# EAGLE design bgboy_modul (EAGLE 6.6.0)
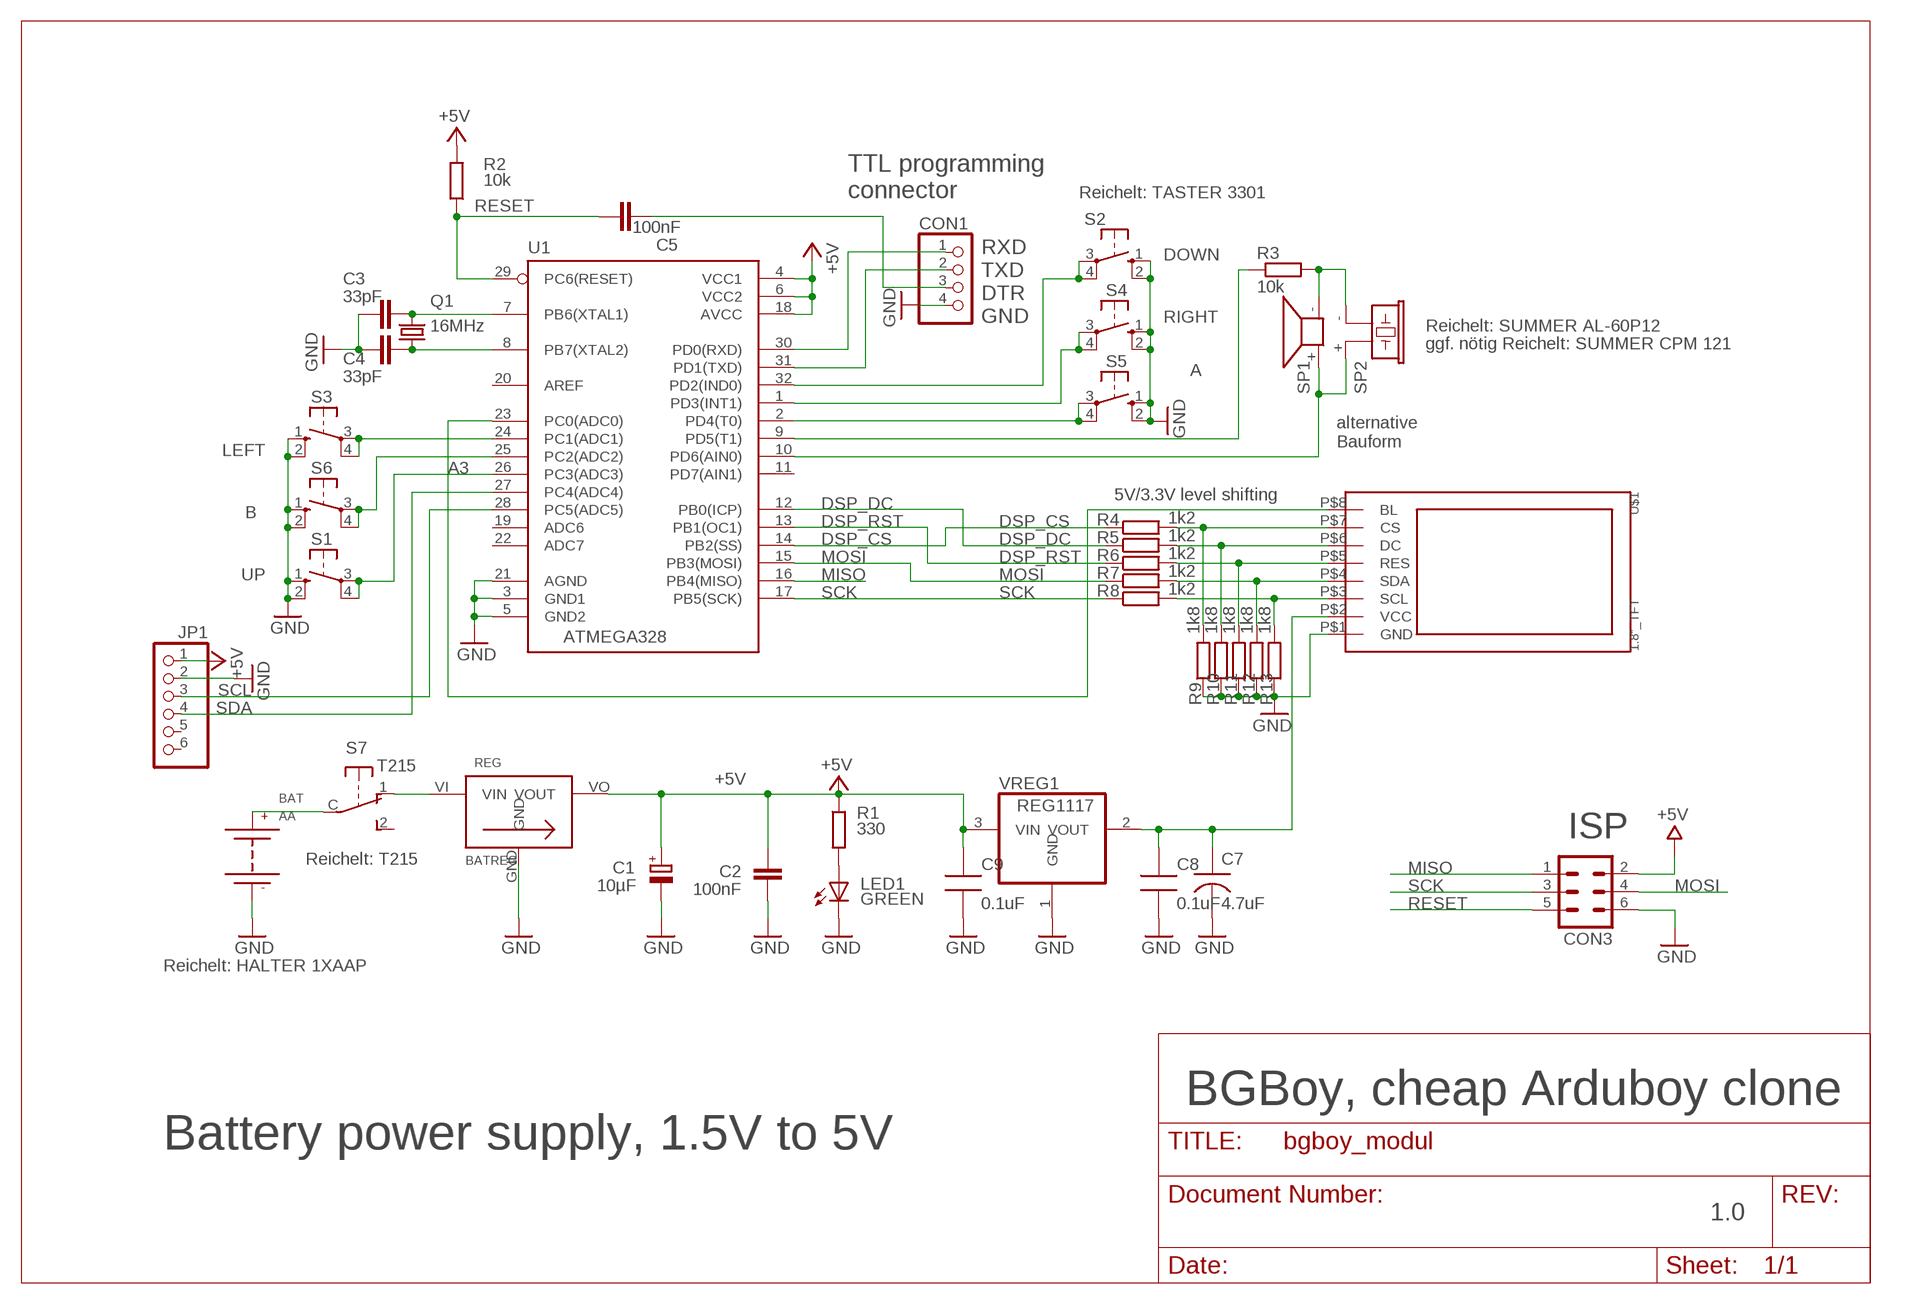
[diagram p0: schematic, sheet 1]

## Parts
BAT  AA  [1XAAP]
C1  10µF  CPOL-EUSMCD  [SMC_D]
C2  100nF  C-EUC0805  [C0805]
C3  33pF  C-EUC0805  [C0805]
C4  33pF  C-EUC0805  [C0805]
C5  100nF  C-EUC0805  [C0805]
C7  4.7uF  CAP-TANA-P  [TAN-A]
C8  0.1uF  CAP0805-NP  [CAP0805-NP]
C9  0.1uF  CAP0805-NP  [CAP0805-NP]
CON1  PINHD-1X4/90  [1X04/90]
CON3  MA03-2  [MA03-2]
JP1  PINHD-1X6  [1X06]
LED1  GREEN  LED3MM  [LED3MM]
Q1  16MHz  CRYSTALHC49UP  [HC49UP]
R1  330  R-EU_R0805  [R0805]
R2  10k  R-EU_R0805  [R0805]
R3  10k  R-EU_R0805  [R0805]
R4  1k2  R-EU_M0805  [M0805]
R5  1k2  R-EU_M0805  [M0805]
R6  1k2  R-EU_M0805  [M0805]
R7  1k2  R-EU_M0805  [M0805]
R8  1k2  R-EU_M0805  [M0805]
R9  1k8  R-EU_M0805  [M0805]
R10  1k8  R-EU_M0805  [M0805]
R11  1k8  R-EU_M0805  [M0805]
R12  1k8  R-EU_M0805  [M0805]
R13  1k8  R-EU_M0805  [M0805]
REG  BATREG  [BATREG]
S1  UP  10-XX  [B3F-10XX]
S2  DOWN  10-XX  [B3F-10XX]
S3  LEFT  10-XX  [B3F-10XX]
S4  RIGHT  10-XX  [B3F-10XX]
S5  A  10-XX  [B3F-10XX]
S6  B  10-XX  [B3F-10XX]
S7  T215  [T215]
SP1  KSS1201  [KSS1201]
SP2  F/CM12P  [F/CM12P]
U1  ATMEGA328  ATMEGA168-20AU  [QFP032]
U$1  1.8"_TFT  [1.8"_TFT]
VREG1  REG1117  [SOT223]

## Nets
+5V [usbvcc]: C1.+ C2.2 C9.1 JP1.1 R1.1 R2.2 REG.VO(VOUT) U1.4(VCC1) U1.6(VCC2) U1.18(AVCC) VREG1.3(VIN)
A0: U1.23(PC0(ADC0)) U$1.P$8(BL)
A1: S3.3(P) S3.4(P1) U1.24(PC1(ADC1))
A2: S6.3(P) S6.4(P1) U1.25(PC2(ADC2))
A3: S1.3(P) S1.4(P1) U1.26(PC3(ADC3))
D0: CON1.1 U1.30(PD0(RXD))
D1: CON1.2 U1.31(PD1(TXD))
D2: S2.3(P) S2.4(P1) U1.32(PD2(IND0))
D3: S4.3(P) S4.4(P1) U1.1(PD3(INT1))
D4: S5.3(P) S5.4(P1) U1.2(PD4(T0))
D5: R3.1 U1.9(PD5(T1))
D7: SP1.+ SP2.+ U1.10(PD6(AIN0))
DSP_CS: R4.1 U1.14(PB2(SS))
DSP_DC: R5.1 U1.12(PB0(ICP))
DSP_RST: R6.1 U1.13(PB1(OC1))
GND [gnd]: BAT.- C1.- C2.1 C3.1 C4.1 C7.2 C8.2 C9.2 CON1.4 CON3.6 JP1.2 LED1.K(C) R9.1 R10.1 R11.1 R12.1 R13.1 REG.GND S1.1(S) S1.2(S1) S2.1(S) S2.2(S1) S3.1(S) S3.2(S1) S4.1(S) S4.2(S1) S5.1(S) S5.2(S1) S6.1(S) S6.2(S1) U1.3(GND1) U1.5(GND2) U1.21(AGND) U$1.P$1(GND) VREG1.1(GND)
MISO: CON3.1 U1.16(PB4(MISO))
MOSI: CON3.4 R7.1 U1.15(PB3(MOSI))
N$1: C4.2 Q1.1 U1.8(PB7(XTAL2))
N$2: C3.2 Q1.2 U1.7(PB6(XTAL1))
N$3: LED1.A R1.2
N$4: REG.VI(VIN) S7.1(O)
N$5: BAT.+ S7.C(P)
N$6: R4.2 R9.2 U$1.P$7(CS)
N$7: R6.2 R11.2 U$1.P$5(RES)
N$8: R3.2 SP1.- SP2.-
N$9: R5.2 R10.2 U$1.P$6(DC)
N$10: C5.2 CON1.3
N$11: C7.1 C8.1 U$1.P$2(VCC) VREG1.2(VOUT)
N$14: R7.2 R12.2 U$1.P$4(SDA)
N$15: R8.2 R13.2 U$1.P$3(SCL)
RESET: C5.1 CON3.5 R2.1 U1.29(PC6(RESET))
SCK: CON3.3 R8.1 U1.17(PB5(SCK))
SCL: JP1.3 U1.28(PC5(ADC5))
SDA: JP1.4 U1.27(PC4(ADC4))
VCC: CON3.2 ; supply symbol labelled +5V
Unconnected: JP1.5 JP1.6 S7.2(S) U1.11(PD7(AIN1)) U1.19(ADC6) U1.20(AREF) U1.22(ADC7)

## Notes on the sheet
- TTL programming
  connector
- Reichelt: TASTER 3301
- RXD
  TXD
  DTR
  GND
- Reichelt: SUMMER AL-60P12
- ggf. nötig Reichelt: SUMMER CPM 121
- alternative
  Bauform
- 5V/3.3V level shifting
- ISP
- Reichelt: T215
- Reichelt: HALTER 1XAAP
- BGBoy, cheap Arduboy clone
- Battery power supply, 1.5V to 5V
- 1.0

## Library data of the parts
BAT = batterie:AA
C1 = rcl:CPOL-EU: POLARIZED CAPACITOR, European symbol
C2 C5 = SmartPrj:C-EU: CAPACITOR, European symbol
C3 C4 = rcl:C-EU: CAPACITOR, European symbol
C7 = MySMD:CAP-TANA-P
C8 C9 = MySMD:CAP0805-NP
CON1 = pinhead:PINHD-1X4: PIN HEADER
CON3 = con-lstb:MA03-2: PIN HEADER; OC_FARNELL: unknown; OC_NEWARK: unknown
JP1 = pinhead:PINHD-1X6: PIN HEADER
LED1 = led:LED: LED OSRAM: - CHIPLED LG R971, LG N971, LY N971, LG Q971, LY Q971, LO R971, LY R971 LH N974, LH R974 LS Q976, LO Q976, LY Q976 LO Q996 - Hyper CHIPLED LW Q18S LB Q993, LB Q99A, LB R99A - SideLED LS A670, LO A670, LY A670, LG A670, LP A670 LB A673, LV A673, LT A673, LW A673 LH A674 LY A675 LS A676, LA A676, LO A676, LY A676, LW A676 LS A679, LY A679, LG A679 - Hyper Micro SIDELED® LS Y876, LA Y876, LO Y876, LY Y876 LT Y87S - SmartLED LW L88C, LW L88S LB L89C, LB L89S, LG L890 LS L89K, LO L89K, LY L89K LS L896, LA L896, LO L896, LY L896 - TOPLED LS T670, LO T670, LY T670, LG T670, LP T670 LSG T670, LSP T670, LSY T670, LOP T670, LYG T670 LG T671, LOG T671, LSG T671 LB T673, LV T673, LT T673, LW T673 LH T674 LS T676, LA T676, LO T676, LY T676, LB T676, LH T676, LSB T676, LW T676 LB T67C, LV T67C, LT T67C, LS T67K, LO T67K, LY T67K, LW E67C LS E67B, LA E67B, LO E67B, LY E67B, LB E67C, LV E67C, LT E67C LW T67C LS T679, LY T679, LG T679 LS T770, LO T770, LY T770, LG T770, LP T770 LB T773, LV T773, LT T773, LW T773 LH T774 LS E675, LA E675, LY E675, LS T675 LS T776, LA T776, LO T776, LY T776, LB T776 LHGB T686 LT T68C, LB T68C - Hyper Mini TOPLED® LB M676 - Mini TOPLED Santana® LG M470 LS M47K, LO M47K, LY M47K Source: http://www.osram.convergy.de LUXEON: - LUMILED® LXK2-PW12-R00, LXK2-PW12-S00, LXK2-PW14-U00, LXK2-PW14-V00 LXK2-PM12-R00, LXK2-PM12-S00, LXK2-PM14-U00 LXK2-PE12-Q00, LXK2-PE12-R00, LXK2-PE12-S00, LXK2-PE14-T00, LXK2-PE14-U00 LXK2-PB12-K00, LXK2-PB12-L00, LXK2-PB12-M00, LXK2-PB14-N00, LXK2-PB14-P00, LXK2-PB14-Q00 LXK2-PR12-L00, LXK2-PR12-M00, LXK2-PR14-Q00, LXK2-PR14-R00 LXK2-PD12-Q00, LXK2-PD12-R00, LXK2-PD12-S00 LXK2-PH12-R00, LXK2-PH12-S00 LXK2-PL12-P00, LXK2-PL12-Q00, LXK2-PL12-R00 Source: www.luxeon.com KINGBRIGHT: KA-3528ASYC Source: www.kingbright.com
Q1 = crystal:CRYSTAL: CRYSTAL; OC_FARNELL: unknown; OC_NEWARK: unknown
R1-R3 = rcl:R-EU_: RESISTOR, European symbol
R4-R13 = resistor:R-EU_: RESISTOR, European symbol
REG = batterie:BATREG
S1-S6 = switch-omron:10-XX: OMRON SWITCH; MPN: B3F-1000; OC_FARNELL: 176432; OC_NEWARK: 36M3542
S7 = bgboy_lite:T215: T215
SP1 = buzzer:KSS1201: SPEAKER Source: Schukat; OC_FARNELL: unknown; OC_NEWARK: unknown
SP2 = buzzer:F/CM12P: BUZZER Source: Buerklin; OC_FARNELL: unknown; OC_NEWARK: unknown
U1 = MySMD:ATMEGA168-20AU
U$1 = tft_1.8:1.8"_TFT: DRIVER IC ST7735 NOMEN_TEC V2.0
VREG1 = burr-brown:REG1117: 800mA and 1A Low Dropout (LDO) Positive Regulator 1.8V, 2.5V, 2.85V, 3.3V, 5V, and Adj; MPN: REG1117; OC_FARNELL: 1097566; OC_NEWARK: 14P6981

## Net classes
1 power: width 0.61 mm, drill 0.61 mm, clearance 0.254 mm
2 gnd: width 0.305 mm, drill 0.559 mm, clearance 0.254 mm
3 usbvcc: width 0.508 mm, drill 0.61 mm, clearance 0.254 mm
4 aref: width 0.406 mm, drill 0.61 mm, clearance 0.254 mm

## Board
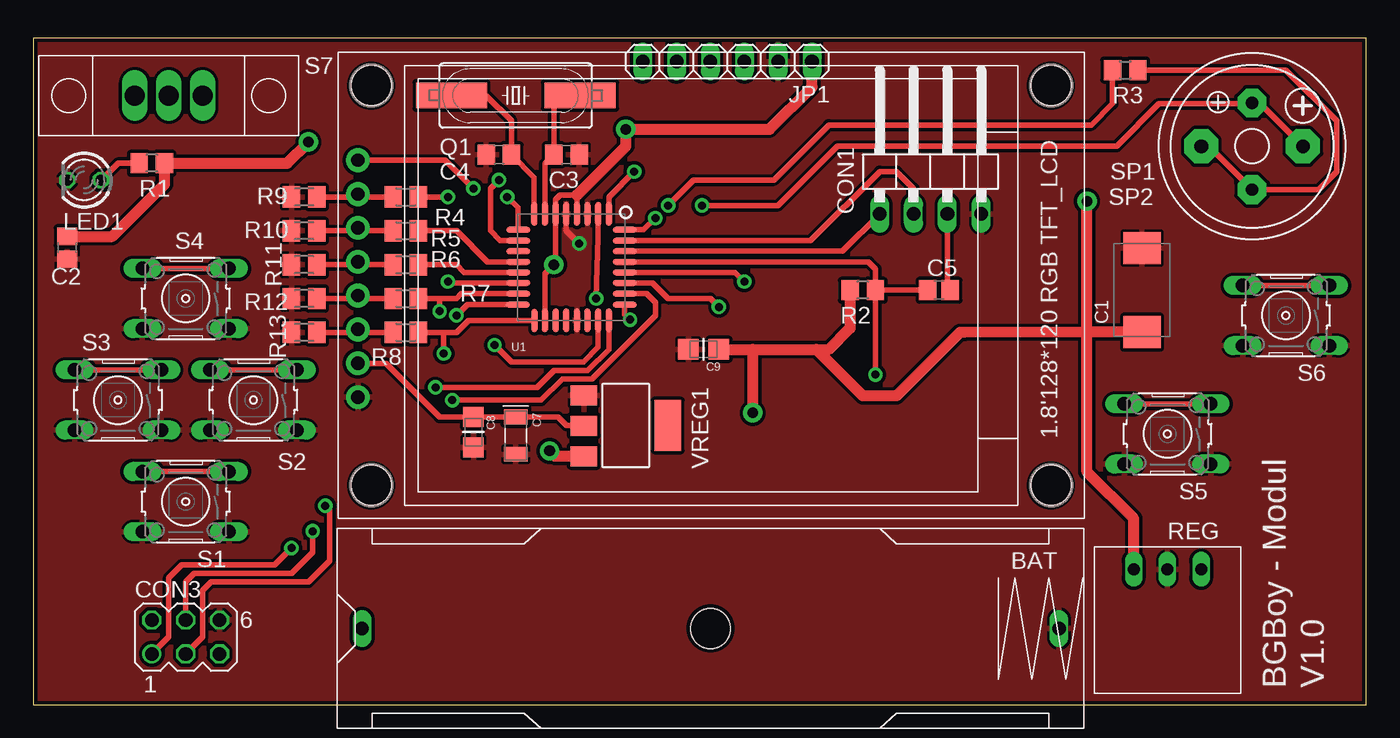
[diagram p1: board, top side]
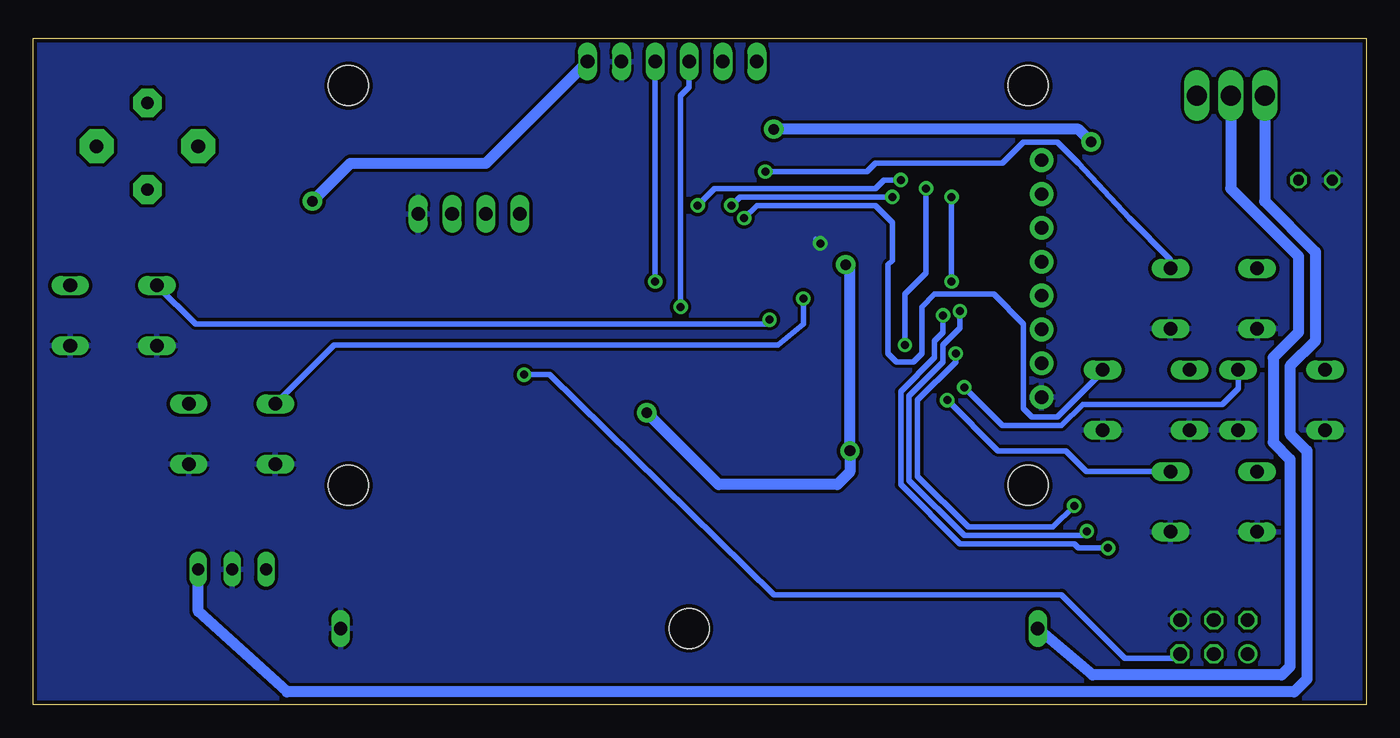
[diagram p2: board, bottom side, seen from below]

Size 100 x 50 mm. Coordinates in mm from the lower left corner, seen from the top.
Outline: 0,0 100,0 100,50 0,50 0,0
Copper layers (1*16): Top 0.035mm / dielectric 1.5mm / Bottom 0.035mm
Design rules "PCB-POOL Standard": minimum track width 0.15mm, minimum drill 0.3mm, track to track 0.15mm, track to pad 0.15mm, pad to pad 0.15mm, via to via 0.15mm, smd to smd 0.15mm, copper to edge 0.3mm, drill to drill 0.2mm, minimum pad ring 0.2mm, minimum via ring 0.15mm, stop-mask expansion 0.075mm, vias tented up to drill 0mil, thermal gap 0.2mm

### Footprints (pad centres in the part's own frame; a part is rotated, then mirrored left to right if it is on the bottom)
1XAAP = drill 1 long: + 26.15,0; - -26.15,0 | hole 3: 0,0
SMC_D = smd 2.4 x 2.8: + -3.15,0; - 3.15,0
C0805 = smd 1.3 x 1.5: 1 -0.85,0; 2 0.85,0
C0805' = smd 1.3 x 1.5: 1 -0.95,0; 2 0.95,0
TAN-A = smd 1.118 x 1.778: 1 0,0; 2 2.794,0
CAP0805-NP = smd 1.524 x 1.524: 1 0,0; 2 2.286,0
1X04/90 = drill 1.016 long: 1 -3.81,-3.81; 2 -1.27,-3.81; 3 1.27,-3.81; 4 3.81,-3.81
MA03-2 = drill 1.016: 1 -2.54,-1.27 | drill 1.016 octagon: 2 -2.54,1.27; 3 0,-1.27; 4 0,1.27; 5 2.54,-1.27; 6 2.54,1.27
1X06 = drill 1.016 long: 1 -6.35,0; 2 -3.81,0; 3 -1.27,0; 4 1.27,0; 5 3.81,0; 6 6.35,0
LED3MM = drill 0.813 octagon: A -1.27,0; K 1.27,0
HC49UP = smd 5.334 x 1.93: 1 -4.826,0; 2 4.826,0
R0805 = smd 1.3 x 1.5: 1 -0.95,0; 2 0.95,0
M0805 = smd 1.3 x 1.6: 1 -0.95,0; 2 0.95,0
BATREG = drill 0.9 long: GND 0,-3.81; VI -2.54,-3.81; VO 2.54,-3.81
B3F-10XX = drill 1.016 long: 1 -3.251,2.261; 2 3.251,2.261; 3 -3.251,-2.261; 4 3.251,-2.261
T215 = drill 1.5 long: 1 -2.54,0; 2 2.54,0; C 0,0
KSS1201 = drill 0.914 pad 2.159 octagon: + 3.251,0; - -3.251,0
F/CM12P = drill 1.016 pad 2.54 octagon: + 3.81,0; - -3.81,0
QFP032 = smd 0.432 x 1.778: 1 0,0; 2 0.8,0; 3 1.599,0; 4 2.399,0; 5 3.199,0; 6 3.998,0; 7 4.798,0; 8 5.598,0; 17 5.588,8.001; 18 4.798,7.997; 19 3.998,7.997; 20 3.199,7.997; 21 2.399,7.997; 22 1.599,7.997; 23 0.799,7.997; 24 0,7.997 | smd 1.778 x 0.432: 9 6.807,1.194; 10 6.807,2.007; 11 6.807,2.794; 12 6.807,3.607; 13 6.807,4.394; 14 6.807,5.182; 15 6.807,5.994; 16 6.816,6.803; 25 -1.194,6.807; 26 -1.194,5.994; 27 -1.194,5.182; 28 -1.194,4.394; 29 -1.194,3.607; 30 -1.194,2.794; 31 -1.194,2.007; 32 -1.194,1.194
1.8"_TFT = drill 1 pad 1.778: P$1 1.5,9.11; P$2 1.5,11.65; P$3 1.5,14.19; P$4 1.5,16.73; P$5 1.5,19.27; P$6 1.5,21.81; P$7 1.5,24.35; P$8 1.5,26.89 | hole 3: 2.5,32.5; 2.5,2.5; 53.5,2.5; 53.5,32.5
SOT223 = smd 1.499 x 2.007: 1 -2.261,-3.15; 2 0.025,-3.15; 3 2.311,-3.15 | smd 3.81 x 2.007: 4 0,3.15

### Placement (x,y rotation side)
BAT  50.8,5.71 180 top
C1  83.19,31.11 90 top
C2  2.54,34.29 90 top
C3  33pF  [C0805']  40.01,41.27 180 top
C4  33pF  [C0805']  34.92,41.27 0 top
C5  67.94,31.11 0 top
C7  36.2,21.59 270 top
C8  33.02,21.59 270 top
C9  51.44,26.67 180 top
CON1  67.31,40.64 0 top
CON3  11.43,5.08 0 top
JP1  52.07,48.26 180 top
LED1  3.81,39.37 180 top
Q1  36.2,45.72 0 top
R1  8.89,40.64 180 top
R2  62.23,31.11 180 top
R3  81.92,47.62 0 top
R4  27.94,38.1 180 top
R5  27.94,35.56 180 top
R6  27.94,33.02 180 top
R7  27.94,30.48 180 top
R8  27.94,27.94 180 top
R9  20.32,38.1 0 top
R10  20.32,35.56 0 top
R11  20.32,33.02 0 top
R12  20.32,30.48 0 top
R13  20.32,27.94 0 top
REG  85.09,6.35 180 top
S1  11.43,15.24 180 top
S2  16.51,22.86 180 top
S3  6.35,22.86 180 top
S4  11.43,30.48 180 top
S5  85.09,20.32 180 top
S6  93.98,29.21 180 top
S7  10.16,45.72 0 top
SP1  91.44,41.91 90 top
SP2  91.44,41.91 0 top
U1  43.18,36.83 180 top
U$1  22.86,13.97 0 top
VREG1  44.45,20.95 270 top

### Tracks (layer width: path | path; a pad name or v marks a point on that pad's centre or on a via)
+5V  (via drill 0.8)
  Top 0.406: U1.18 38.38,32.35 v39.05,33.02 39.18,33.15 U1.6 39.18,37.91 39.51,38.24 40.78,38.24 U1.4 40.78,37.96 40.64,38.1
  Top 0.813: C2.2 5.93,35.14 9.84,39.05 R1.1 19.05,40.64 v20.64,42.23 | 39.19,32.84 v39.05,33.02 | VREG1.3 39.14,18.64 v38.73,19.05 | R2.2 61.28,28.26 59.69,26.67 58.74,26.67 | 40.78,38.24 44.45,41.91 v44.45,43.18 55.24,43.18 58.42,46.35 JP1.1 | C1.+ 78.74,27.96 | 78.74,27.96 69.85,27.94 69.53,27.94 64.77,23.18 62.23,23.18 58.74,26.67 | C9.1 53.98,26.67 | 53.98,26.67 58.74,26.67 | v53.98,21.91 53.98,26.67 | REG.VO 82.55,13.97 79.06,17.46 79.06,27.95 | 79.06,27.95 78.74,27.96 | 79.06,27.95 v79.06,37.78
  Bottom 0.813: v44.45,43.18 21.59,43.18 v20.64,42.23 | v39.05,33.02 38.73,32.7 v38.73,19.05 38.73,17.46 39.69,16.51 48.58,16.51 v53.98,21.91 | v79.06,37.78 76.2,40.64 66.04,40.64 JP1.1 58.42,47.94
A0  (via drill 0.6)
  Top 0.406: U$1.P$8 30.89,40.86 v33.02,38.73 | v34.61,26.99 35.88,25.72 41.27,25.72 42.38,26.82 U1.23
  Bottom 0.406: v33.02,38.73 33.02,32.38 34.61,30.8 v34.61,26.99
A1  (via drill 0.6)
  Top 0.406: S3.4 S3.3 | v30.16,23.81 37.78,23.81 39.05,25.08 41.59,25.08 43.18,26.67 U1.24
  Bottom 0.406: S3.3 9.6,23.74 10.79,22.54 21.27,22.54 22.86,20.95 27.3,20.95 v30.16,23.81
A2  (via drill 0.6)
  Top 0.406: S6.4 S6.3 | U1.25 44.37,29.29 v44.77,28.89
  Bottom 0.406: v44.77,28.89 45.09,28.57 87.83,28.57 S6.4
A3  (via drill 0.6)
  Top 0.406: S1.4 S1.3 | v31.43,22.86 38.1,22.86 39.69,24.45 41.91,24.45 46.67,29.21 46.67,30.16 46,30.84 U1.26
  Bottom 0.406: S1.3 20.99,17.5 22.54,19.05 27.62,19.05 v31.43,22.86
D0
  Top 0.406: U1.30 60.71,34.04 CON1.1
D1
  Top 0.406: U1.31 58.32,34.82 63.5,40.01 64.77,40.01 66.04,38.73 CON1.2
D2  (via drill 0.6)
  Top 0.406: S2.4 S2.3 | U1.32 45.8,35.64 v46.67,36.51
  Bottom 0.406: S2.3 19.65,25.12 23.18,21.59 25.08,21.59 25.72,22.23 25.72,28.57 27.94,30.8 32.38,30.8 33.34,29.84 33.34,26.35 33.97,25.72 35.24,25.72 35.88,26.35 35.88,33.02 35.56,33.34 35.56,36.2 36.83,37.47 45.72,37.47 v46.67,36.51
D3  (via drill 0.6)
  Top 0.406: S4.4 S4.3 | U1.1 43.18,38.1 v45.09,40.01
  Bottom 0.406: v45.09,40.01 37.47,40.01 36.83,40.64 27.3,40.64 25.72,42.23 23.18,42.23 21.59,40.64 17.78,36.51 14.68,33.41 S4.3
D4  (via drill 0.6)
  Top 0.406: S5.4 S5.3 | U1.2 42.38,35.09 v42.23,30.48
  Bottom 0.406: v42.23,30.48 42.23,28.57 44.13,26.99 77.43,26.99 S5.4
D5  (via drill 0.6)
  Top 0.406: U1.9 36.37,37.29 v35.56,38.1 | v47.62,37.47 49.53,39.37 55.56,39.37 59.69,43.5 79.38,43.5 | 79.38,43.5 | 79.38,43.5 80.97,45.09 R3.1
  Bottom 0.406: v35.56,38.1 46.99,38.1 v47.62,37.47
D7  (via drill 0.6)
  Top 0.406: SP2.+ 92,45.16 SP1.+ 91.36,45.09 84.45,45.09 81.28,41.91 60.33,41.91 55.88,37.47 v50.16,37.47 | U1.10 35.03,34.82 34.29,35.56 34.29,38.73 v34.92,39.37
  Bottom 0.406: v34.92,39.37 36.2,39.37 36.83,38.73 48.9,38.73 v50.16,37.47
DSP_CS  (via drill 0.6)
  Top 0.406: U1.14 31.22,31.65 v31.11,31.75 | v31.11,38.1 R4.1
  Bottom 0.406: v31.11,31.75 v31.11,38.1
DSP_DC
  Top 0.406: U1.12 34.09,33.22 31.75,35.56 R5.1
DSP_RST
  Top 0.406: U1.13 32.33,32.44 31.75,33.02 R6.1
GND  (via drill 0.6)
  Top 0.406: U1.5 39.98,35.58 v40.96,34.61
  Bottom 0.406: v40.96,34.61 41.27,34.92
  pour Top: 0,0 0,49.85 100.01,49.85 100.01,0
  pour Bottom: 0,0 0,49.85 100.01,49.85 100.01,0
MISO  (via drill 0.6)
  Top 0.406: CON3.1 10.16,5.08 10.16,9.53 11.11,10.48 18.1,10.48 v19.37,11.75 | U1.16 32.57,30.03 v31.75,29.21
  Bottom 0.406: v31.75,29.21 31.75,27.94 32.38,27.3 32.38,26.04 34.92,23.5 34.92,16.51 30.48,12.06 21.91,12.06 21.59,11.75 v19.37,11.75
MOSI  (via drill 0.6)
  Top 0.406: U1.15 32.11,30.84 31.75,30.48 30.48,30.48 | 30.48,30.48 R7.1 | CON3.4 11.43,9.21 12.06,9.84 19.37,9.84 20.95,11.43 v20.95,13.02 | 30.48,30.48 v30.48,29.53
  Bottom 0.406: v30.48,29.53 30.48,28.26 31.75,26.99 31.75,25.72 34.29,23.18 34.29,16.83 30.16,12.7 21.27,12.7 v20.95,13.02
N$1
  Top 0.406: U1.8 37.58,39.57 C4.2 35.88,43.82 33.97,45.72 Q1.1
N$2
  Top 0.406: U1.7 38.38,40.6 C3.2 39.05,45.66 Q1.2
N$3
  Top 0.406: R1.2 6.35,40.64 LED1.A
N$4
  Bottom 0.813: S7.1 7.62,37.78 3.81,33.97 3.81,27.3 5.71,25.4 5.71,20.32 4.45,19.05 4.45,1.91 5.4,0.95 80.96,0.95 87.63,6.99 REG.VI
N$5
  Bottom 0.813: S7.C 10.16,38.73 5.08,33.66 5.08,27.94 6.99,26.04 6.99,19.68 5.71,18.41 5.71,2.86 6.35,2.22 20.52,2.22 BAT.+
N$6
  Top 0.406: R9.2 24.36,38.1 | R4.2 24.36,38.1 | 24.36,38.1 U$1.P$7
N$7
  Top 0.406: R11.2 24.36,33.02 | R6.2 24.36,33.02 | 24.36,33.02 U$1.P$5
N$8
  Top 0.406: SP2.- 88.19,41.91 SP1.- 96.44,38.66 97.79,40.01 97.79,43.81 93.98,47.62 R3.2
N$9
  Top 0.406: R10.2 24.36,35.56 | R5.2 24.36,35.56 | 24.36,35.56 U$1.P$6
N$10
  Top 0.406: CON1.3 68.58,31.33 C5.2
N$11
  Top 0.406: U$1.P$2 26.45,25.62 30.48,21.59 C8.1 C7.1 39.37,21.59 40.01,20.95 41.27,20.95 VREG1.2
N$14
  Top 0.406: R12.2 24.36,30.48 | R7.2 24.36,30.48 | 24.36,30.48 U$1.P$4
N$15
  Top 0.406: R13.2 24.36,27.94 | R8.2 24.36,27.94 | 24.36,27.94 U$1.P$3
RESET  (via drill 0.6)
  Top 0.406: R2.1 C5.1 | U1.29 62.66,33.22 63.18,32.7 R2.1 | R2.1 63.18,25.4 v63.18,24.77
  Bottom 0.406: v63.18,24.77 61.28,24.77 44.45,8.26 22.86,8.26 18.1,3.49 14.29,3.49 CON3.5
SCK  (via drill 0.6)
  Top 0.406: U1.17 32.64,28.83 31.75,27.94 30.8,27.94 | R8.1 30.8,27.94 | 30.8,27.94 v30.8,26.35 | CON3.3 12.7,5.08 12.7,8.57 13.34,9.21 20.64,9.21 22.23,10.79 22.23,14.61 v21.91,14.92
  Bottom 0.406: v30.8,26.35 30.8,25.72 33.66,22.86 33.66,17.14 29.84,13.34 23.5,13.34 v21.91,14.92
SCL  (via drill 0.6)
  Top 0.406: U1.28 52.65,32.44 v53.34,31.75
  Bottom 0.406: v53.34,31.75 JP1.3
SDA  (via drill 0.6)
  Top 0.406: U1.27 46.46,31.65 47.62,30.48 50.8,30.48 v51.44,29.84
  Bottom 0.406: v51.44,29.84 51.44,45.72 50.8,46.35 JP1.4

### Text on the board
tPlace: BGBoy - Modul | V1.0